# EAGLE design Plantersens Soil Sensor (EAGLE 9.6.2)
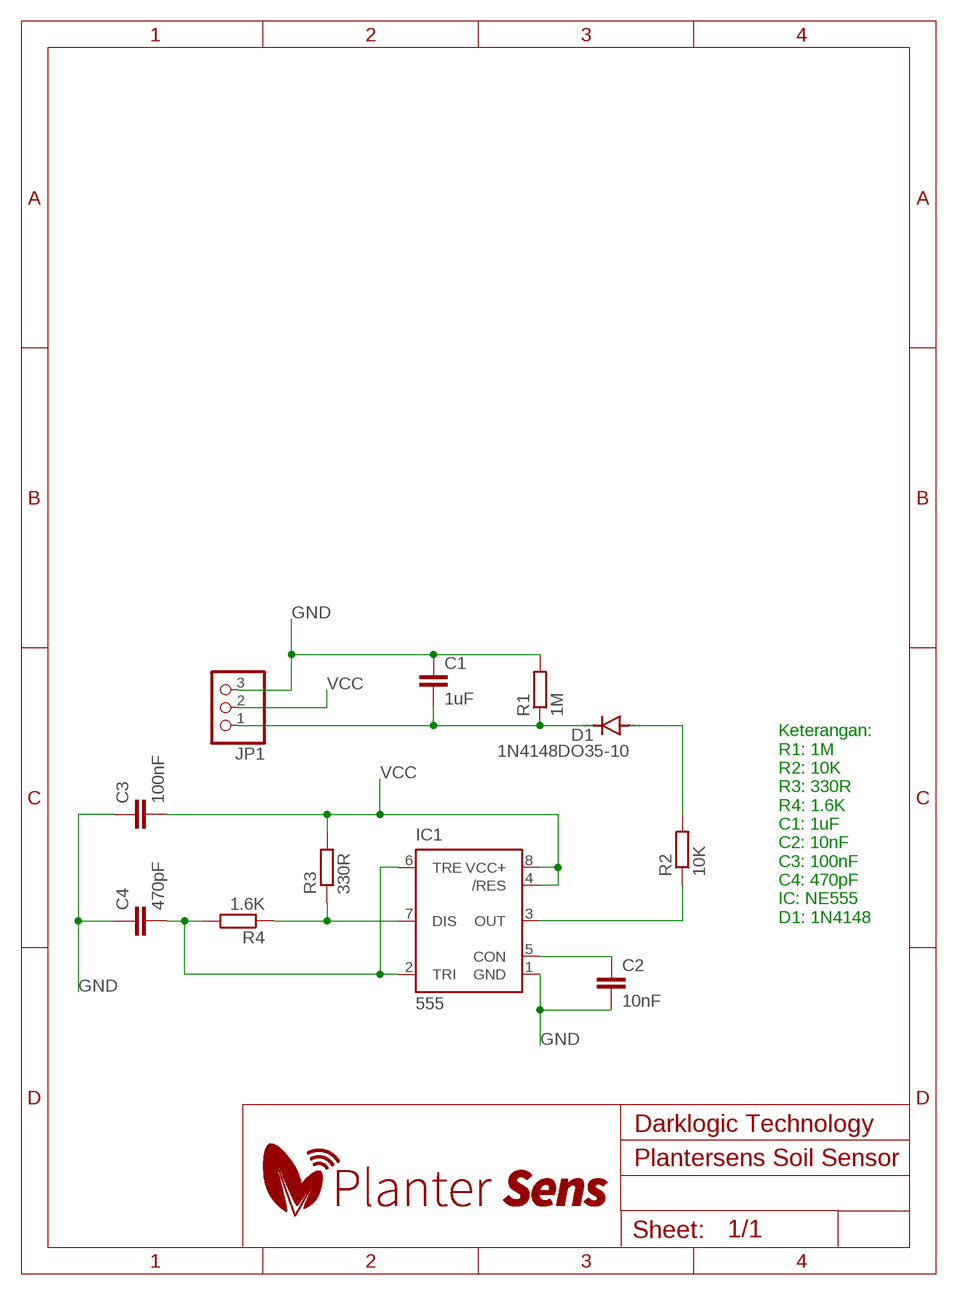
[diagram p0: schematic, sheet 1]

## Parts
C1  1uF  C2.5/2  [C2.5-2]
C2  10nF  C2.5/2  [C2.5-2]
C3  100nF  C2.5/2  [C2.5-2]
C4  470pF  C2.5/2  [C2.5-2]
D1  1N4148DO35-10  [DO35-10]
IC1  555  555KIT  [DIP08-KIT]
JP1  PINHD-1X3  [1X03]
R1  1M  R-EU_0207/10  [0207/10]
R2  10K  R-EU_0207/10  [0207/10]
R3  330R  R-EU_0207/10  [0207/10]
R4  1.6K  R-EU_0207/10  [0207/10]

## Nets
GND: C1.1 C2.2 C3.1 C4.1 IC1.1(GND) JP1.3 R1.2
N$3: D1.A R2.2
N$4: IC1.3(OUT) R2.1
N$8: IC1.7(DIS) R3.1 R4.1
N$9: C2.1 IC1.5(CON)
N$11: C4.2 IC1.2(TRI) IC1.6(TRE) R4.2
SIG: C1.2 D1.C JP1.1 R1.1
VCC: C3.2 IC1.4(/RES) IC1.8(VCC+) JP1.2 R3.2

## Notes on the sheet
- Keterangan:
  R1: 1M
  R2: 10K
  R3: 330R
  R4: 1.6K
  C1: 1uF
  C2: 10nF
  C3: 100nF
  C4: 470pF
  IC: NE555
  D1: 1N4148
- Darklogic Technology

## Library data of the parts
C1-C4 = capacitor-wima:C: CAPACITOR naming: grid - package width
D1 = diode:1N4148: DIODE high speed (Philips)
IC1 = SparkFun-IC-Special-Function:555: General purpose bipolar Timer Datasheet <http://www.sparkfun.com/datasheets/Components/General/ne555.pdf> SparkFun Products SparkFun SparkPunk Sequencer Kit <https://www.sparkfun.com/products/12707> (KIT-12707) Storefront Component: 555 Timer <https://www.sparkfun.com/products/9273> (COM-09273) Two parts valid for production: VFP: IC-11930 (M7555 PTH) VFP: IC-09173 (555 PTH) - Preferred; PROD_ID: IC-09173; PROD_ID_ALT: IC-11930
JP1 = pinhead:PINHD-1X3: PIN HEADER
R1-R4 = rcl:R-EU_: RESISTOR, European symbol; SPICEPREFIX: R

## Board
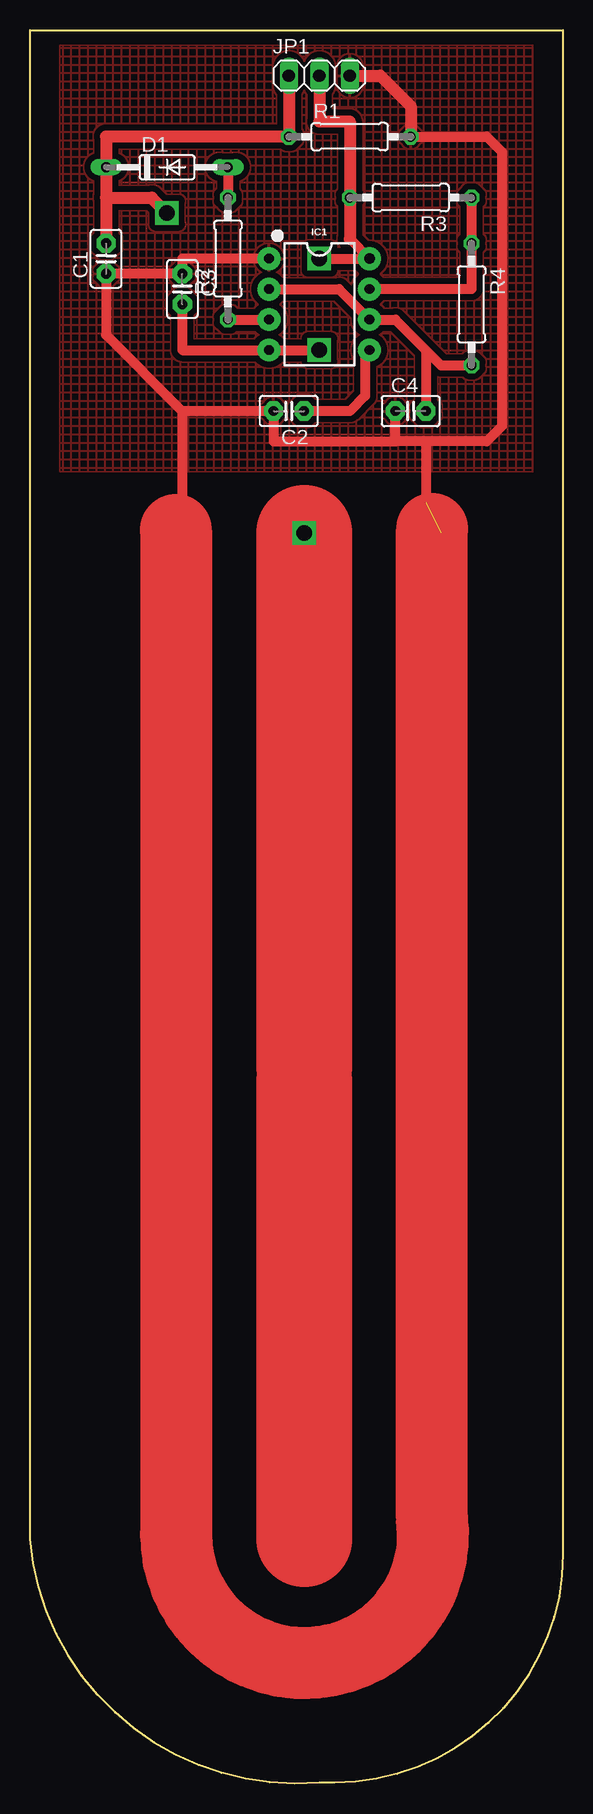
[diagram p1: board, top side]
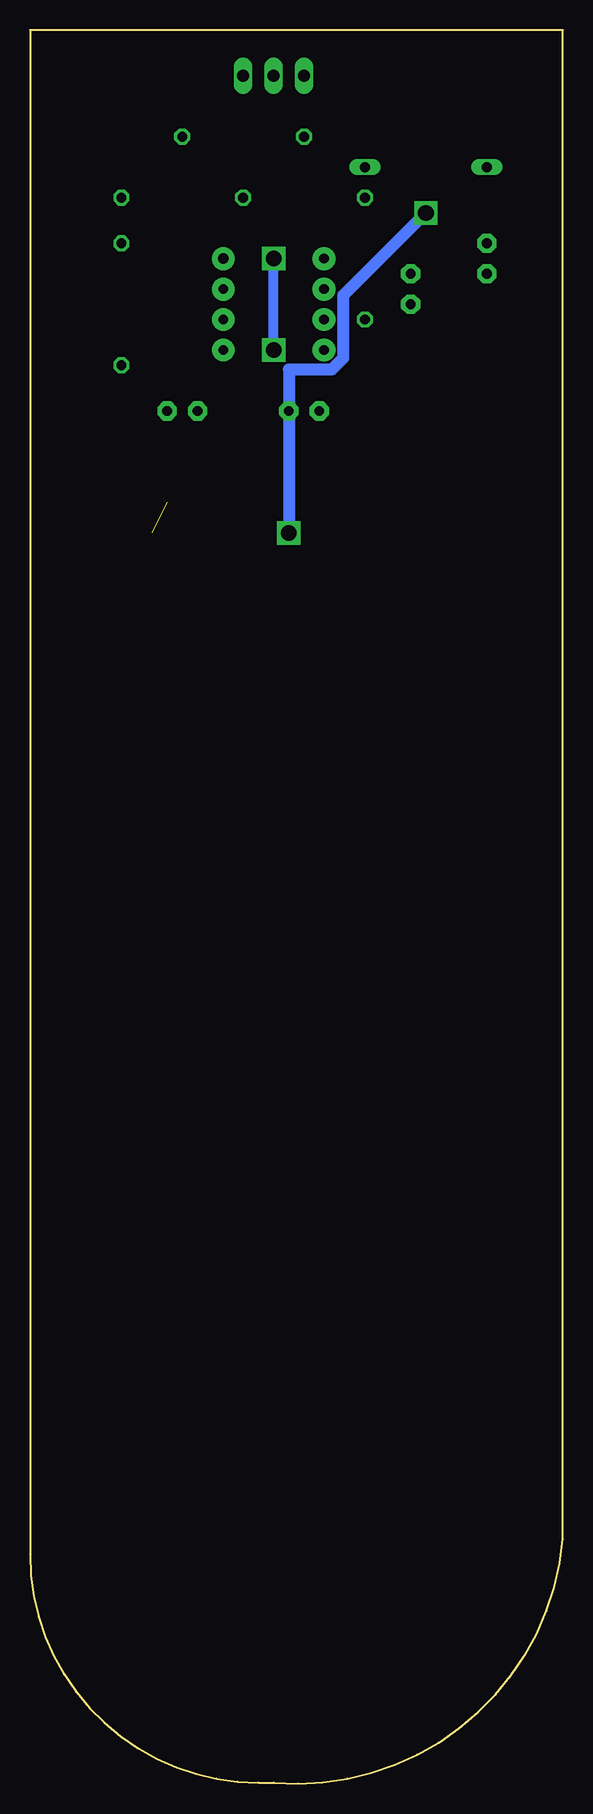
[diagram p2: board, bottom side, seen from below]

Size 44.45 x 146.13 mm. Coordinates in mm from the lower left corner, seen from the top.
Outline: 0,146.13 44.45,146.13 44.45,19.13 arc-90 25.4,0.08 24.13,0.08 arc-90 0,20.4 0,146.13
Copper layers (1*16): Top 0.035mm / dielectric 1.5mm / Bottom 0.035mm
Design rules "default": minimum track width 6mil, minimum drill 0.35mm, track to track 6mil, track to pad 6mil, pad to pad 6mil, via to via 6mil, smd to smd 6mil, copper to edge 40mil, drill to drill 6mil, minimum pad ring 10mil, minimum via ring 8mil, stop-mask expansion 4mil, vias tented up to drill 0mil, thermal gap 10mil

### Footprints (pad centres in the part's own frame; a part is rotated, then mirrored left to right if it is on the bottom)
C2.5-2 = drill 0.813 pad 1.6 octagon: 1 -1.27,0; 2 1.27,0
DO35-10 = drill 0.813 long: A 5.08,0; C -5.08,0
DIP08-KIT = drill 0.813 pad 1.905: 1 -3.81,-4.191; 2 -1.27,-4.191; 3 1.27,-4.191; 4 3.81,-4.191; 5 3.81,4.191; 6 1.27,4.191; 7 -1.27,4.191 | drill 0.864 pad 1.905: 8 -3.81,4.191
1X03 = drill 1.016 long: 1 -2.54,0; 2 0,0; 3 2.54,0
0207/10 = drill 0.813 octagon: 1 -5.08,0; 2 5.08,0

### Placement (x,y rotation side)
C1  6.35,127.08 90 top
C2  21.59,114.38 180 top
C3  12.7,124.54 270 top
C4  31.75,114.38 0 top
D1  11.43,134.7 0 top
IC1  24.13,123.27 270 top
JP1  24.13,142.32 0 top
R1  26.67,137.24 0 top
R2  16.51,127.08 90 top
R3  31.75,132.16 180 top
R4  36.83,123.27 270 top

### Tracks (layer width: path | path; a pad name or v marks a point on that pad's centre or on a via)
GND  (1 unrouted)
  Top 0.813: IC1.1 12.7,127.08 C3.1 C1.1 6.35,120.73 12.7,114.38 | 12.7,114.38 C2.2 20.32,111.84 30.48,111.84 | 30.48,111.84 C4.1 | R1.2 38.1,137.24 39.37,135.97 39.37,113.11 38.1,111.84 33.02,111.84 | 33.02,111.84 30.48,111.84 | 12.7,114.38 12.7,105.49 | 12.7,105.49 13.97,105.49 13.97,101.68 11.43,101.68 11.43,105.49 12.7,105.49 | 33.53,104.53 33.54,104.53 arc-45 34.29,104.22 | 33.02,111.84 33.02,106.76
  Top 1.016: JP1.3 29.21,142.32 31.75,139.78 R1.2
  Top 6: 33.53,104.53 33.53,22.1 arc-187 12.19,20.76 12.19,104.45
  pour Top (isolate 0.5, hatched): 2.54,144.86 41.91,144.86 41.91,109.3 2.54,109.3
N$3
  Top 0.813: D1.A R2.2
N$4
  Top 0.813: R2.1 IC1.3
N$8
  Top 0.813: R3.1 R4.1 36.83,124.54 IC1.7
N$9
  Top 0.813: IC1.5 27.94,119.08 27.94,115.65 26.67,114.38 C2.1
N$11
  Top 0.813: IC1.2 25.78,124.54 IC1.6 30.48,122 33.02,119.46 | 33.02,119.46 34.29,118.19 R4.2 | 33.02,119.46 C4.2
SIG  (via drill 1.3)
  Top 1.016: JP1.1 R1.1 6.35,137.24 D1.C 6.35,132.16 | 6.35,132.16 C1.2 | 6.35,132.16 10.16,132.16 v11.43,130.89
  Top 5: 22.86,59.77 22.86,58.5
  Top 8: v22.86,104.22 22.86,59.77 | 22.86,58.5 22.86,20.4
  Bottom 1.016: v11.43,130.89 18.33,123.99 18.33,118.79 19.29,117.83 22.86,117.83 v22.86,104.22
VCC  (via drill 1.3)
  Top 0.813: C3.2 12.7,119.46 IC1.4 v24.13,119.46 | v24.13,127.08 IC1.8 26.67,128.73
  Top 1.016: 26.67,128.73 R3.2 26.67,138.51 24.13,138.51 JP1.2
  Bottom 0.813: v24.13,119.46 v24.13,127.08